# Altium schematic sheet Supply.SchDoc: Power Supply
size 420 x 297 mm; Author: G.K.; CompanyName: WUT; DrawnBy: G.K.; Organization: CERN; Address1: Warsaw Univeristy of Technology; Address2: Nowowiejska 15/19; DocumentNumber: 5; Revision: -; SheetNumber: 5; SheetTotal: 5; EDA_Number: ARTIQ; Projet: Sampler; ModifiedBy: -; CreateDate: XX/XX/XXXX; CheckedDate: -; Title2: converters + LDOs v2.2; DivGrp: ISE; Designer: G.K.; ModifiedDate: -; ProjectName: Sampler
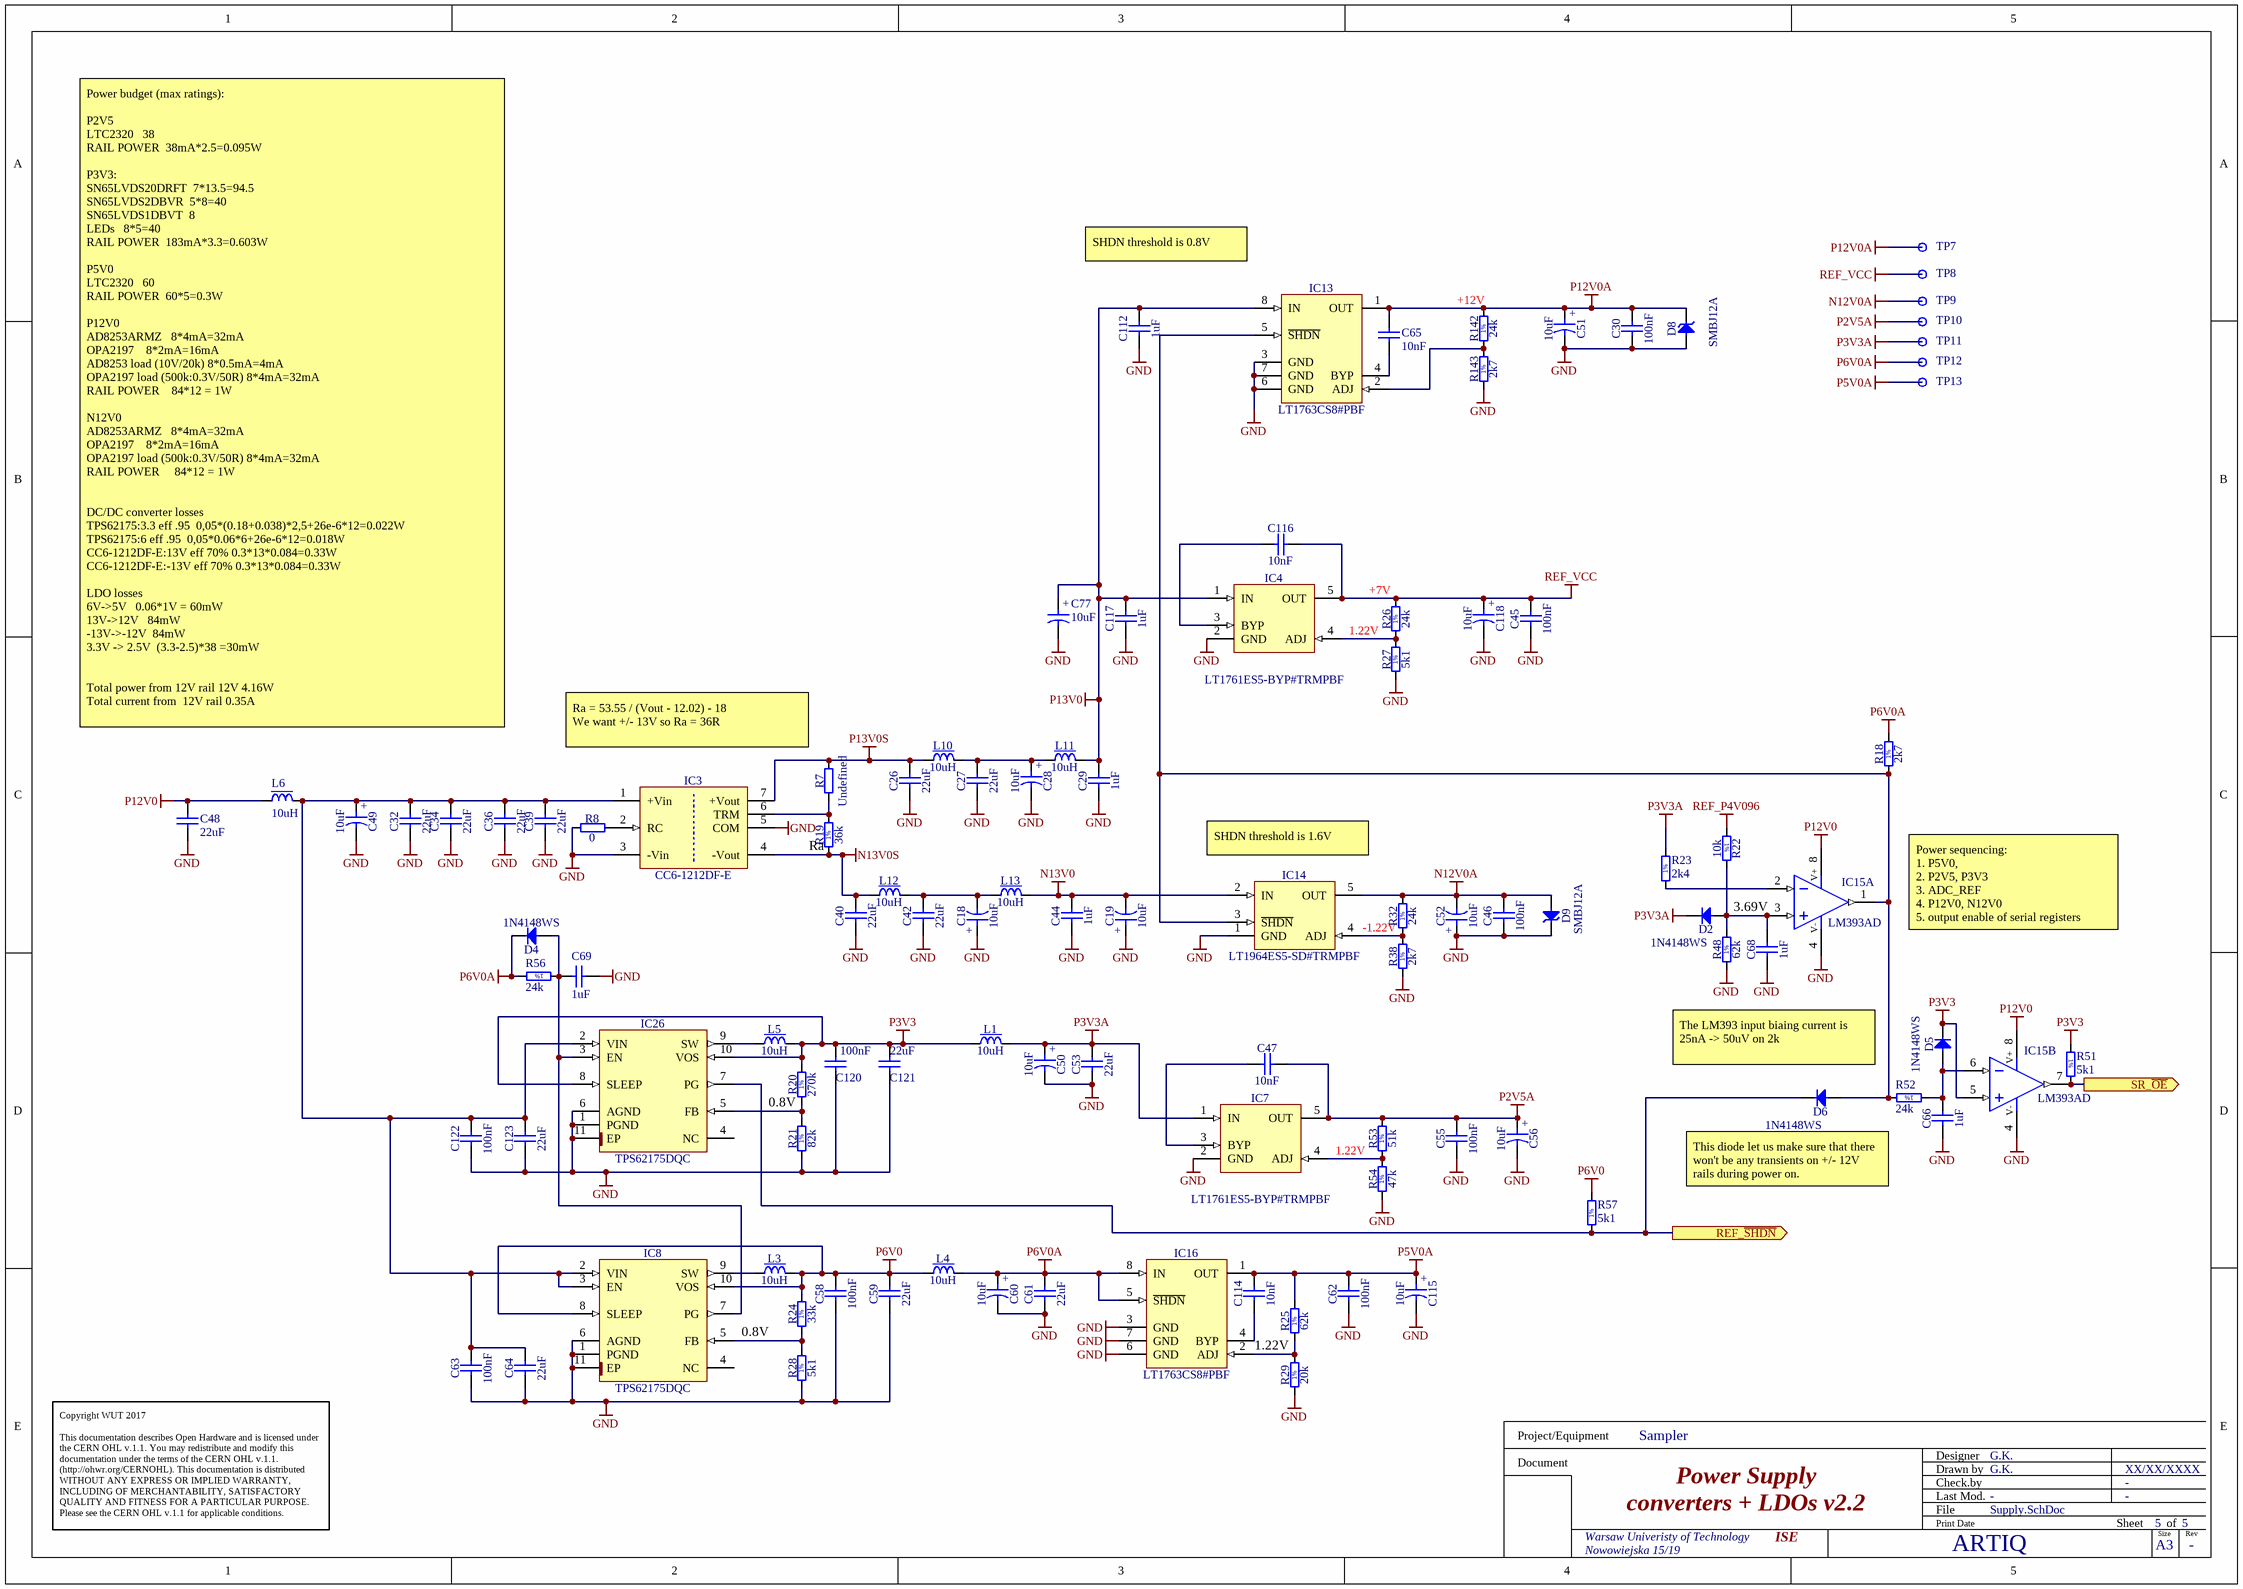
[diagram p0: Supply.SchDoc]

## Parts
C18  10uF  [CAPMP3216X180N]
C19  10uF  [CAPMP3216X180N]
C26  22uF  [CAPC2012X135N]
C27  22uF  [CAPC2012X135N]
C28  10uF  [CAPMP3216X180N]
C29  1uF  [CAPC1608X87N]
C30  100nF  [CAPC1005X55N]
C32  22uF  [CAPC2012X135N]
C34  22uF  [CAPC2012X135N]
C36  22uF  [CAPC2012X135N]
C39  22uF  [CAPC2012X135N]
C40  22uF  [CAPC2012X135N]
C42  22uF  [CAPC2012X135N]
C44  1uF  [CAPC1608X87N]
C45  100nF  [CAPC1005X55N]
C46  100nF  [CAPC1005X55N]
C47  10nF  [CAPC1608X87N]
C48  22uF  [CAPC2012X135N]
C49  10uF  [CAPMP3216X180N]
C50  10uF  [CAPMP3216X180N]
C51  10uF  [CAPMP3216X180N]
C52  10uF  [CAPMP3216X180N]
C53  22uF  [CAPC2012X135N]
C55  100nF  [CAPC1005X55N]
C56  10uF  [CAPMP3216X180N]
C58  100nF  [CAPC1005X55N]
C59  22uF  [CAPC2012X135N]
C60  10uF  [CAPMP3216X180N]
C61  22uF  [CAPC2012X135N]
C62  100nF  [CAPC1005X55N]
C63  100nF  [CAPC1005X55N]
C64  22uF  [CAPC2012X135N]
C65  10nF  [CAPC1608X87N]
C66  1uF  [CAPC1608X87N]
C68  1uF  [CAPC1608X87N]
C69  1uF  [CAPC1608X87N]
C77  10uF  [CAPMP3216X180N]
C112  1uF  [CAPC1608X87N]
C114  10nF  [CAPC1608X87N]
C115  10uF  [CAPMP3216X180N]
C116  10nF  [CAPC1608X87N]
C117  1uF  [CAPC1608X87N]
C118  10uF  [CAPMP3216X180N]
C120  100nF  [CAPC1005X55N]
C121  22uF  [CAPC2012X135N]
C122  100nF  [CAPC1005X55N]
C123  22uF  [CAPC2012X135N]
D2  1N4148WS  [SODFL2512X100N]
D4  1N4148WS  [SODFL2512X100N]
D5  1N4148WS  [SODFL2512X100N]
D6  1N4148WS  [SODFL2512X100N]
D8  SMBJ12A  [DIOM5336X265N]
D9  SMBJ12A  [DIOM5336X265N]
IC3  CC6-1212DF-E  [CC6-1212DF-E]
IC4  LT1761ES5-BYP#TRMPBF  [SOT95P280X100-5N]
IC7  LT1761ES5-BYP#TRMPBF  [SOT95P280X100-5N]
IC8  TPS62175DQC  [SON50P200X300X80-11N-R94X250]
IC13  LT1763CS8#PBF  [SOIC127P600X175-8N]
IC14  LT1964ES5-SD#TRMPBF  [SOT95P280X100-5N]
IC15  LM393AD  [SOIC127P600X175-8N]  (parts A,B of 2)
IC16  LT1763CS8#PBF  [SOIC127P600X175-8N]
IC26  TPS62175DQC  [SON50P200X300X80-11N-R94X250]
L1  10uH  [IND_MURATA-PS_8400]
L3  10uH  [IND_MURATA-PS_8400]
L4  10uH  [IND_MURATA-PS_8400]
L5  10uH  [IND_MURATA-PS_8400]
L6  10uH  [IND_MURATA-PS_8400]
L10  10uH  [IND_MURATA-PS_8400]
L11  10uH  [IND_MURATA-PS_8400]
L12  10uH  [IND_MURATA-PS_8400]
L13  10uH  [IND_MURATA-PS_8400]
R7  Undefined  [RESC1608X55N]
R8  0  [RESC1005X40N]
R18  2k7  [RESC1608X55N]
R19  36k  [RESC1608X55N]
R20  270k  [RESC1608X55N]
R21  82k  [RESC1608X55N]
R22  10k  [RESC1005X40N]
R23  2k4  [RESC1005X40N]
R24  33k  [RESC1005X40N]
R25  62k  [RESC1005X40N]
R26  24k  [RESC1608X55N]
R27  5k1  [RESC1005X40N]
R28  5k1  [RESC1005X40N]
R29  20k  [RESC1005X40N]
R32  24k  [RESC1608X55N]
R38  2k7  [RESC1608X55N]
R48  62k  [RESC1005X40N]
R51  5k1  [RESC1005X40N]
R52  24k  [RESC1608X55N]
R53  51k  [RESC1005X40N]
R54  47k  [RESC1005X40N]
R56  24k  [RESC1608X55N]
R57  5k1  [RESC1005X40N]
R142  24k  [RESC1608X55N]
R143  2k7  [RESC1608X55N]
TP7  Test Point  [TPS127]  (value not drawn)
TP8  Test Point  [TPS127]  (value not drawn)
TP9  Test Point  [TPS127]  (value not drawn)
TP10  Test Point  [TPS127]  (value not drawn)
TP11  Test Point  [TPS127]  (value not drawn)
TP12  Test Point  [TPS127]  (value not drawn)
TP13  Test Point  [TPS127]  (value not drawn)

## Ports
REF_~{SHDN} (out), SR_~{OE} (out)

## Nets
GND: C18.1 C19.1 C26.1 C27.1 C28.2 C29.1 C30.1 C32.1 C34.1 C36.1 C39.1 C40.1 C42.1 C44.1 C45.1 C46.1 C48.1 C49.2 C50.2 C51.2 C52.1 C53.1 C55.1 C56.2 C58.1 C59.1 C60.2 C61.1 C62.1 C63.1 C64.1 C66.1 C68.1 C69.1 C77.2 C112.1 C115.2 C117.1 C118.2 C120.1 C121.1 C122.1 C123.1 D8.2(A) D9.1(C) IC3.3(-Vin) IC3.5(COM) IC4.2(GND) IC7.2(GND) IC8.1(PGND) IC8.6(AGND) IC8.11(EP) IC13.3(GND) IC13.6(GND) IC13.7(GND) IC14.1(GND) IC15.4(V-) IC16.3(GND) IC16.6(GND) IC16.7(GND) IC26.1(PGND) IC26.6(AGND) IC26.11(EP) R8.1 R21.1 R27.1 R28.1 R29.1 R38.1 R48.1 R54.1 R143.1
N12V0A: C46.2 C52.2 D9.2(A) IC14.5(OUT) R32.2 TP9.1
N13V0: C19.2 C44.2 IC14.2(IN) L13.2
N13V0S: C40.2 IC3.4(-Vout) L12.1 R19.1
P2V5A: C47.2 C55.2 C56.1 IC7.5(OUT) R53.2 TP10.1
P3V3: C120.2 C121.2 D5.1(C) IC15.5(IN+) IC26.8(SLEEP) IC26.10(VOS) L1.1 L5.2 R20.2 R51.1
P3V3A: C50.1 C53.2 D2.1(C) IC7.1(IN) L1.2 R23.2 TP11.1
P5V0A: C62.2 C114.2 C115.1 IC16.1(OUT) R25.2 TP13.1
P6V0: C58.2 C59.2 IC8.8(SLEEP) IC8.10(VOS) L3.2 L4.1 R24.2 R57.2
P6V0A: C60.1 C61.2 D4.1(C) IC16.5(~{SHDN}) IC16.8(IN) L4.2 R18.2 R56.2 TP12.1
P12V0: C48.2 IC15.8(V+) L6.1
P12V0A: C30.2 C51.1 C65.2 D8.1(C) IC13.1(OUT) R142.2 TP7.1
P13V0: C29.2 C77.1 C112.2 C117.2 IC4.1(IN) IC13.8(IN) L11.2
P13V0S: C26.2 IC3.7(+Vout) L10.1 R7.2
REF_P4V096: R22.1
REF_VCC: C45.2 C116.2 C118.1 IC4.5(OUT) R26.2 TP8.1
REF_~{SHDN}: D6.1(C) IC26.7(PG) R57.1 ; port REF_~{SHDN}
SR_~{OE}: IC15.7(OUT) R51.2 ; port SR_~{OE}
NetC18_2: C18.2 C42.2 L12.2 L13.1
NetC27_2: C27.2 C28.1 L10.2 L11.1
NetC32_2: C32.2 C34.2 C36.2 C39.2 C49.1 C63.2 C64.2 C122.2 C123.2 IC3.1(+Vin) IC8.2(VIN) IC8.3(EN) IC26.2(VIN) L6.2
NetC47_1: C47.1 IC7.3(BYP)
NetC65_1: C65.1 IC13.4(BYP)
NetC66_2: C66.2 D5.2(A) IC15.6(IN-) R52.1
NetC68_2: C68.2 D2.2(A) IC15.3(IN+) R22.2 R48.2
NetC69_2: C69.2 D4.2(A) IC8.7(PG) IC26.3(EN) R56.1
NetC114_1: C114.1 IC16.4(BYP)
NetC116_1: C116.1 IC4.3(BYP)
NetD6_2: D6.2(A) IC13.5(~{SHDN}) IC14.3(~{SHDN}) IC15.1(OUT) R18.1 R52.2
NetIC3_2: IC3.2(RC) R8.2
NetIC3_6: IC3.6(TRM) R7.1 R19.2
NetIC4_4: IC4.4(ADJ) R26.1 R27.2
NetIC7_4: IC7.4(ADJ) R53.1 R54.2
NetIC8_5: IC8.5(FB) R24.1 R28.2
NetIC8_9: IC8.9(SW) L3.1
NetIC13_2: IC13.2(ADJ) R142.1 R143.2
NetIC14_4: IC14.4(ADJ) R32.1 R38.2
NetIC15_2: IC15.2(IN-) R23.1
NetIC16_2: IC16.2(ADJ) R25.1 R29.2
NetIC26_5: IC26.5(FB) R20.1 R21.2
NetIC26_9: IC26.9(SW) L5.1

Not connected (* = marked no-connect by the designer): IC8 4(NC); IC26 4(NC)

## Notes on the sheet
- SHDN threshold is 0.8V
- (near R142) +12V
- (near R26) +7V
- 1.22V
- Power budget (max ratings):
  P2V5
  LTC2320			38
  RAIL POWER		38mA*2.5=0.095W
  P3V3:
  SN65LVDS20DRFT		7*13.5=94.5
  SN65LVDS2DBVR		5*8=40
  SN65LVDS1DBVT		8
  LEDs			8*5=40
  RAIL POWER		183mA*3.3=0.603W
  P5V0
  LTC2320			60
  RAIL POWER		60*5=0.3W
  P12V0
  AD8253ARMZ 		8*4mA=32mA
  OPA2197 			8*2mA=16mA
  AD8253 load (10V/20k)	8*0.5mA=4mA
  OPA2197 load (500k:0.3V/50R)	8*4mA=32mA
  RAIL POWER 		 84*12 = 1W
  N12V0
  AD8253ARMZ 		8*4mA=32mA
  OPA2197 			8*2mA=16mA
  OPA2197 load (500k:0.3V/50R)	8*4mA=32mA
  RAIL POWER  		 84*12 = 1W
  DC/DC converter losses
  TPS62175:3.3 eff .95		0,05*(0.18+0.038)*2,5+26e-6*12=0.022W
  TPS62175:6 eff .95		0,05*0.06*6+26e-6*12=0.018W
  CC6-1212DF-E:13V eff 70%	0.3*13*0.084=0.33W
  CC6-1212DF-E:-13V eff 70%	0.3*13*0.084=0.33W
  LDO losses
  6V->5V			0.06*1V = 60mW
  13V->12V			84mW
  -13V->-12V		84mW
  3.3V -> 2.5V		(3.3-2.5)*38 =30mW
  Total power from 12V rail	12V 4.16W
  Total current from  12V rail	0.35A
- (near R7) Ra = 53.55 / (Vout - 12.02) - 18
  We want +/- 13V so Ra = 36R
- (near R19) Ra
- SHDN threshold is 1.6V
- -1.22V
- 3.69V
- Power sequencing:
  1. P5V0,
  2. P2V5, P3V3
  3. ADC_REF
  4. P12V0, N12V0
  5. output enable of serial registers
- The LM393 input biaing current is 25nA -> 50uV on 2k
- (near R20) 0.8V
- This diode let us make sure that there won't be any transients on +/- 12V rails during power on.
- 0.8V
- Copyright WUT 2017
  This documentation describes Open Hardware and is licensed under the CERN OHL v.1.1. You may redistribute and modify this documentation under the terms of the CERN OHL v.1.1. (http://ohwr.org/CERNOHL). This documentation is distributed WITHOUT ANY EXPRESS OR IMPLIED WARRANTY, INCLUDING OF MERCHANTABILITY, SATISFACTORY QUALITY AND FITNESS FOR A PARTICULAR PURPOSE. Please see the CERN OHL v.1.1 for applicable conditions.
- Project/Equipment
- Document
- Designer
- Drawn by
- Check.by
- File
- Last Mod.
- Print Date
- Sheet
- Size
- A3
- of
- Rev
- (in symbol CTE3216-18_10UF_16V_20%_AVX_TCJ) +
- (in symbol R0402_2K4_1%_0.0625W_100PPM) 1%
- (in symbol R0402_5K1_1%_0.0625W_100PPM) 1%
- (in symbol R0402_10K_1%_0.0625W_100PPM) 1%
- (in symbol R0402_20K_1%_0.0625W_100PPM) 1%
- (in symbol R0402_33K_1%_0.0625W_100PPM) 1%
- (in symbol R0402_47K_1%_0.0625W_100PPM) 1%
- (in symbol R0402_51K_1%_0.0625W_100PPM) 1%
- (in symbol R0402_62K_1%_0.0625W_100PPM) 1%
- (in symbol R0603_2K7_1%_0.1W_100PPM) 1%
- (in symbol R0603_24K_1%_0.1W_100PPM) 1%
- (in symbol R0603_36K_1%_0.1W_100PPM) 1%
- (in symbol R0603_82K_1%_0.1W_100PPM) 1%
- (in symbol R0603_270K_1%_0.1W_100PPM) 1%

## Library data of the parts
C18 C19 C28 C49-C52 C56 C60 C77 C115 C118 = CTE3216-18_10UF_16V_20%_AVX_TCJ: Polarised capacitor; Part Description: ESR 0R200 Tantalum Solid Electrolytic Chip Capacitor with Conductive Polymer Electrode; Manufacturer: AVX; Manufacturer Part Number: TCJA106M016R0200; Voltage: 16V; Tolerance: ±20%; Part Number: CTE3216-18_10UF_16V_20%_AVX_TCJ; Component Kind: Standard; Component Type: Standard; Pin Count: 2; Value: 10uF; Status: Preferred; Case: A; Mounted: Yes; Socket: No; SMD: Yes; Sense: No; ComponentHeight: 1.8mm; HelpURL: \\cern.ch\dfs\Applications\Altium\Datasheets\CTE_AVX_TCJ.pdf; Author: CERN DEM JLC; CreateDate: 29.03.2012; LatestRevisionDate: 29.03.2012
C26 C27 C32 C34 C36 C39 C40 C42 C48 C53 C59 C61 C64 C121 C123 = CC0805_22UF_16V_10%_X5R: Non-polarised capacitor; Part Description: SMD Multilayer Chip Ceramic Capacitor; Manufacturer: GENERIC; Manufacturer1 Part Number: C2012X5R1C226KT; Voltage: 16V; TC: X5R; Tolerance: ±10%; Part Number: CC0805_22UF_16V_10%_X5R; Component Kind: Standard; Component Type: Standard; Pin Count: 2; Value: 22uF; Status: Preferred; Manufacturer Part Number: CC0805_22UF_16V_10%_X5R; Case: 0805; Mounted: Yes; Socket: No; SMD: Yes; Sense: No; Manufacturer1 Example: TDK; Manufacturer1 ComponentHeight: 1.35mm; HelpURL: \\cern.ch\dfs\Applications\Altium\Datasheets\CC0805_X5R_TDK_C.pdf; Author: CERN DEM JLC; CreateDate: 25.10.2012; LatestRevisionDate: 25.10.2012
C29 C44 C66 C68 C69 C112 C117 = CC0603_1UF_25V_10%_X7R: Non-polarised capacitor; Part Description: SMD Multilayer Chip Ceramic Capacitor; Manufacturer: GENERIC; Manufacturer1 Part Number: GRM188R71E105KA12D; Voltage: 25V; TC: X7R; Tolerance: ±10%; Part Number: CC0603_1UF_25V_10%_X7R; Component Kind: Standard; Component Type: Standard; Pin Count: 2; Value: 1uF; Status: None; Manufacturer Part Number: CC0603_1UF_25V_10%_X7R; Case: 0603; Mounted: Yes; Socket: No; SMD: Yes; Sense: No; Manufacturer1 Example: MURATA; Manufacturer1 ComponentHeight: 0.9mm; HelpURL: \\cern.ch\dfs\Applications\Altium\Datasheets\CC0603_X7R_MURATA.pdf; Author: CERN DEM JLC; CreateDate: 18.01.2011; LatestRevisionDate: 18.01.2011
C30 C45 C46 C55 C58 C62 C63 C120 C122 = CC0402_100NF_16V_10%_X5R: Non-polarised capacitor; Part Description: SMD Multilayer Chip Ceramic Capacitor; Manufacturer: GENERIC; Manufacturer1 Part Number: GRM155R61C104KA88D; Voltage: 16V; TC: X5R; Tolerance: ±10%; Part Number: CC0402_100NF_16V_10%_X5R; Component Kind: Standard; Component Type: Standard; Pin Count: 2; Value: 100nF; Status: None; Manufacturer Part Number: CC0402_100NF_16V_10%_X5R; Case: 0402; Mounted: Yes; Socket: No; SMD: Yes; Sense: No; Manufacturer1 Example: MURATA; Manufacturer1 ComponentHeight: 0.55mm; HelpURL: \\cern.ch\dfs\Applications\Altium\Datasheets\CC0402_X5R_MURATA_GRM.pdf; Author: CERN DEM JLC; CreateDate: 10.12.2013; LatestRevisionDate: 10.12.2013
C47 C65 C114 C116 = CC0603_10NF_50V_10%_X7R: Non-polarised capacitor; Part Description: SMD Multilayer Chip Ceramic Capacitor; Manufacturer: GENERIC; Manufacturer1 Part Number: 223858615636; Voltage: 50V; TC: X7R; Tolerance: ±10%; Part Number: CC0603_10NF_50V_10%_X7R; Component Kind: Standard; Component Type: Standard; Pin Count: 2; Value: 10nF; Status: Preferred; Manufacturer Part Number: CC0603_10NF_50V_10%_X7R; Case: 0603; Mounted: Yes; Socket: No; SMD: Yes; Sense: No; Manufacturer1 Example: PHYCOMP; Manufacturer1 ComponentHeight: 0.87mm; HelpURL: \\cern.ch\dfs\Applications\Altium\Datasheets\CC0603_X7R_PHYCOMP.pdf; Author: CERN DEM JLC; CreateDate: 03.12.2007; LatestRevisionDate: 03.12.2007
D2 D4-D6 = 1N4148WS: Diode; Part Description: Small Signal Diodes; Manufacturer: FAIRCHILD SEMICONDUCTOR; Voltage: 75V; Power: 150mA; PressFit: No; Bonding: No; Part Number: 1N4148WS; Component Kind: Standard; Component Type: Standard; Device: 1N4148WS; PackageDescription: SODFL Diode; 1.70mm W X 1.25mm L X 1.00mm H body, IPC Medium Density; Manufacturer Part Number: 1N4148WS; Pin Count: 2; Case: SOD-323F; Mounted: Yes; Socket: No; SMD: Yes; Sense: No; ComponentHeight: 1mm; HelpURL: \\cern.ch\dfs\Applications\Altium\Datasheets\1N4148WS.pdf; Author: CERN DEM JLC; CreateDate: 12.05.2011; LatestRevisionDate: 12.05.2011
D8 D9 = SMBJ12A: Zener Diode; Part Description: Uni-Directional Transient Voltage Suppressor Diode; Manufacturer: FAIRCHILD SEMICONDUCTOR; Voltage: 12V; Power: 600W; PressFit: No; Bonding: No; Part Number: SMBJ12A; Component Kind: Standard; Component Type: Standard; Device: SMBJ12A; PackageDescription: DO-214-AA/SMB Diode, Molded Body; 5.34mm L X 3.625mm W X 2.65mm H, IPC Medium Density; Manufacturer Part Number: SMBJ12A; Pin Count: 2; Case: DO-214AA; Mounted: Yes; Socket: No; SMD: Yes; Sense: No; ComponentHeight: 2.65mm; HelpURL: \\cern.ch\dfs\Applications\Altium\Datasheets\SMBJ.pdf; Author: CERN DEM JLC; CreateDate: 10.04.2013; LatestRevisionDate: 10.04.2013
IC3 = DC/DC_CC6-1212DF-E: CONV DC/DC 6W DUAL 12V +-12V PCB; Manufacturer: TDK-Lambda Americas Inc.; PressFit: No; Bonding: No; Part Number: CC6-1212DF-E; Component Kind: Standard; Component Type: Standard; Device: CC6-1212DF-E; PackageDescription: CC6 Series, Body 0.900 x 0.831 x 0.335, Regulated; Part Description: CONV DC/DC 6W DUAL 12V +-12V PCB; Manufacturer Part Number: CC6-1212DF-E; Pin Count: 7; Mounted: Yes; Socket: No; SMD: No; Sense: No; ComponentHeight: 10.45mm; Author: GK; CreateDate: 17.12.2016; LatestRevisionDate: 17.12.2016
IC4 IC7 = LT1761ES5-BYP#TRMPBF: 100mA, Low Noise, LDO Micropower Adjustable Regulator in SOT-23; Part Description: 1.22V to 20V, 100mA, Low Noise, LDO Adjustable Micropower Regulator; Manufacturer: LINEAR TECHNOLOGY; PressFit: No; Bonding: No; Part Number: LT1761ES5-BYP#TRMPBF; Component Kind: Standard; Component Type: Standard; Device: LT1761ES5-BYP#TRMPBF; PackageDescription: SOT23, 0.95mm pitch; 5 pin, 1.6mm W X 2.9mm L, IPC Medium Density; Manufacturer Part Number: LT1761ES5-BYP#TRMPBF; Pin Count: 5; Case: SOT23; Mounted: Yes; Socket: No; SMD: Yes; Sense: No; ComponentHeight: 1mm; HelpURL: \\cern.ch\dfs\Applications\Altium\Datasheets\LT1761ES5-SD#TRMPBF.pdf; Author: CERN DEM MR; CreateDate: 17.02.2016; LatestRevisionDate: 17.02.2016
IC8 IC26 = TPS62175DQC: 4.75-28VDC to 1-6VDC, 500mA Step-Down Converter With Sleep Mode; Manufacturer: TEXAS INSTRUMENTS; PressFit: No; Bonding: No; Part Number: TPS62175DQC; Component Kind: Standard; Component Type: Standard; Device: TPS62175DQC; PackageDescription: SON, 10-Leads, Body 2x3mm, Pitch 0.5mm, Thermal Pad 0.94x2.5mm, IPC Medium Density; Part Description: 4.75-28VDC to 1-6VDC, 500mA Step-Down Converter With Sleep Mode; Manufacturer Part Number: TPS62175DQC; Pin Count: 11; Case: SON10; Mounted: Yes; Socket: No; SMD: Yes; Sense: No; ComponentHeight: 0.8mm; HelpURL: \\cern.ch\dfs\Applications\Altium\Datasheets\TPS62175DQC.pdf; Author: CERN DEM JMW; CreateDate: 11.08.2015; LatestRevisionDate: 11.08.2015
IC13 IC16 = LT1763CS8#PBF: 1.22V to 20V 500mA, Low Noise, LDO Adjustable Micropower Regulator; Manufacturer: LINEAR TECHNOLOGY; PressFit: No; Bonding: No; Part Number: LT1763CS8#PBF; Component Kind: Standard; Component Type: Standard; Device: LT1763CS8#PBF; PackageDescription: SOIC 8, Pitch 1.27mm, Body 4x5mm, IPC Medium Density; Part Description: 1.22V to 20V 500mA, Low Noise, LDO Adjustable Micropower Regulator; Manufacturer Part Number: LT1763CS8#PBF; Pin Count: 8; Case: SOIC8; Mounted: Yes; Socket: No; SMD: Yes; Sense: No; ComponentHeight: 1.75mm; HelpURL: \\cern.ch\dfs\Applications\Altium\Datasheets\LT1763CS8#PBF.pdf; Author: CERN DEM JLC; CreateDate: 11.01.2010; LatestRevisionDate: 11.01.2010
IC14 = LT1964ES5-SD#TRMPBF: 200mA, Low Noise, Low Dropout Negative Micropower Regulator; Part Description: -1.22V to -20V, 200mA, Low Noise, Low Dropout Negative Micropower Regulator; Manufacturer: LINEAR TECHNOLOGY; PressFit: No; Bonding: No; Part Number: LT1964ES5-SD#TRMPBF; Component Kind: Standard; Component Type: Standard; Device: LT1964ES5-SD#TRMPBF; PackageDescription: SOT23, 0.95mm pitch; 5 pin, 1.75mm W X 3.00mm L, IPC Medium Density; Manufacturer Part Number: LT1964ES5-SD#TRMPBF; Pin Count: 5; Case: SOT23-5; Mounted: Yes; Socket: No; SMD: Yes; Sense: No; ComponentHeight: 1mm; HelpURL: \\cern.ch\dfs\Applications\Altium\Datasheets\LT1964ES5-SD#TRMPBF.pdf; Author: CERN DEM JLC; CreateDate: 05.05.2009; LatestRevisionDate: 05.05.2009
IC15 = LM393AD: Dual Operational Amplifier; Part Description: Dual Differential Comparator; Manufacturer: TEXAS INSTRUMENTS; PressFit: No; Bonding: No; Part Number: LM393AD; Component Kind: Standard; Component Type: Standard; Device: LM393AD; PackageDescription: SOIC 8, Pitch 1.27mm - Body 4x5mm, IPC Medium Density; Manufacturer Part Number: LM393AD; Pin Count: 8; Case: SOIC8; Mounted: Yes; Socket: No; SMD: Yes; Sense: No; ComponentHeight: 1.75mm; Author: CERN DEM JLC; HelpURL: \\cern.ch\dfs\Applications\Altium\Datasheets\LM393AD.pdf; CreateDate: 22.10.2013; LatestRevisionDate: 22.10.2013
L1 L3-L6 L10-L13 = IND_10UH_10%_MURATA-PS_8400: Inductor With Core; Part Description: Miniature Surface Mount Power Inductor (8400 Serie); Manufacturer: MURATA POWER SOLUTIONS; Manufacturer Part Number: 84103C; Power: 950mA; Resistance: 0.24R; Tolerance: ±10%; Part Number: IND_10UH_10%_MURATA-PS_8400; Component Kind: Standard; Component Type: Standard; Pin Count: 2; Value: 10uH; Status: None; Mounted: Yes; Socket: No; SMD: Yes; Sense: No; ComponentHeight: 2.9mm; HelpURL: \\cern.ch\dfs\Applications\Altium\Datasheets\IND_MURATA-PS_8400.pdf; Author: CERN DEM JLC; CreateDate: 02.07.2012; LatestRevisionDate: 02.07.2012
R7 = R0603_NO-VALUE: Resistor; Part Description: Reserved Footprint For a 0603 (1608) Chip Resistor; Mounted: No; Part Number: R0603_NO-VALUE; Component Kind: Standard; Component Type: Standard; Pin Count: 2; Value: Undefined; Status: None; Manufacturer: Undefined; Manufacturer Part Number: R0603_NO-VALUE; Case: 0603; Sense: No; Socket: No; SMD: Yes; Manufacturer1 Example: Undefined; Manufacturer1 Part Number: Undefined; Manufacturer1 ComponentHeight: Undefined; HelpURL: Undefined; Author: CERN DEM JLC; CreateDate: 03.12.2007; LatestRevisionDate: 13.03.2008
R8 = R0402_0R_JUMPER: Resistor; Part Description: 1A (0.05R Max DC Resistance) Zero Ohm Jumper; Manufacturer: GENERIC; Manufacturer1 Part Number: 232270591001L; Part Number: R0402_0R_JUMPER; Component Kind: Standard; Component Type: Standard; Pin Count: 2; Value: 0; Status: Not recommended; Manufacturer Part Number: R0402_0R_JUMPER; Case: 0402; Mounted: Yes; Sense: No; Socket: No; SMD: Yes; Manufacturer1 Example: YAGEO PHYCOMP; Manufacturer1 ComponentHeight: 0.4mm; HelpURL: \\cern.ch\dfs\Applications\Altium\Datasheets\R0402_Phycomp_RC0402.pdf; Author: CERN DEM JLC; CreateDate: 03.12.2007; LatestRevisionDate: 17.10.2012
R18 R38 R143 = R0603_2K7_1%_0.1W_100PPM: Resistor - 1%; Part Description: General Purpose Thick Film Chip Resistor; Manufacturer: GENERIC; Manufacturer1 Part Number: RC0603FR-072K7L; Power: 0.1W; TC: ±100ppm/°C; Part Number: R0603_2K7_1%_0.1W_100PPM; Component Kind: Standard; Component Type: Standard; Pin Count: 2; Value: 2k7; Status: Preferred; Tolerance: ±1%; Manufacturer Part Number: R0603_2K7_1%_0.1W_100PPM; Case: 0603; Mounted: Yes; Sense: No; Socket: No; SMD: Yes; Manufacturer1 Example: YAGEO PHYCOMP; Manufacturer1 ComponentHeight: 0.55mm; HelpURL: \\cern.ch\dfs\Applications\Altium\Datasheets\R0603_PHYCOMP_RC0603.pdf; Author: CERN DEM JLC; CreateDate: 02.05.2011; LatestRevisionDate: 02.05.2011
R19 = R0603_36K_1%_0.1W_100PPM: Resistor - 1%; Part Description: General Purpose Thick Film Chip Resistor; Manufacturer: GENERIC; Manufacturer1 Part Number: NRC06F3602TRF; Power: 0.1W; TC: ±100ppm/°C; PressFit: No; Part Number: R0603_36K_1%_0.1W_100PPM; Component Kind: Standard; Component Type: Standard; Pin Count: 2; Value: 36k; Status: Preferred; Tolerance: ±1%; Manufacturer Part Number: R0603_36K_1%_0.1W_100PPM; Case: 0603; Mounted: Yes; Sense: No; Socket: No; SMD: Yes; Manufacturer1 Example: NIC COMPONENT; Manufacturer1 ComponentHeight: 0.55mm; HelpURL: \\cern.ch\dfs\Applications\Altium\Datasheets\R0603_NIC_NRC.pdf; Author: CERN DEM JLC; CreateDate: 03.12.2007; LatestRevisionDate: 13.03.2008
R20 = R0603_270K_1%_0.1W_100PPM: Resistor - 1%; Part Description: General Purpose Thick Film Chip Resistor; Manufacturer: GENERIC; Manufacturer1 Part Number: NRC06F2703TRF; Power: 0.1W; TC: ±100ppm/°C; Part Number: R0603_270K_1%_0.1W_100PPM; Component Kind: Standard; Component Type: Standard; Pin Count: 2; Value: 270k; Status: Preferred; Tolerance: ±1%; Manufacturer Part Number: R0603_270K_1%_0.1W_100PPM; Case: 0603; Mounted: Yes; Sense: No; Socket: No; SMD: Yes; Manufacturer1 Example: NIC COMPONENT; Manufacturer1 ComponentHeight: 0.55mm; HelpURL: \\cern.ch\dfs\Applications\Altium\Datasheets\R0603_NIC_NRC.pdf; Author: CERN DEM JLC; CreateDate: 03.12.2007; LatestRevisionDate: 13.03.2008
R21 = R0603_82K_1%_0.1W_100PPM: Resistor - 1%; Part Description: General Purpose Thick Film Chip Resistor; Manufacturer: GENERIC; Manufacturer1 Part Number: NRC06F8202TRF; Power: 0.1W; TC: ±100ppm/°C; Part Number: R0603_82K_1%_0.1W_100PPM; Component Kind: Standard; Component Type: Standard; Pin Count: 2; Value: 82k; Status: Preferred; Tolerance: ±1%; Manufacturer Part Number: R0603_82K_1%_0.1W_100PPM; Case: 0603; Mounted: Yes; Sense: No; Socket: No; SMD: Yes; Manufacturer1 Example: NIC COMPONENT; Manufacturer1 ComponentHeight: 0.55mm; HelpURL: \\cern.ch\dfs\Applications\Altium\Datasheets\R0603_NIC_NRC.pdf; Author: CERN DEM JLC; CreateDate: 03.12.2007; LatestRevisionDate: 13.03.2008
R22 = R0402_10K_1%_0.0625W_100PPM: Resistor - 1%; Part Description: General Purpose Thick Film Chip Resistor; Manufacturer: GENERIC; Manufacturer1 Part Number: 232270671003L; TC: ±100ppm/°C; PressFit: No; Part Number: R0402_10K_1%_0.0625W_100PPM; Component Kind: Standard; Component Type: Standard; Pin Count: 2; Value: 10k; Status: Not Recommended; Power: 0.0625W; Tolerance: ±1%; Manufacturer Part Number: R0402_10K_1%_0.0625W_100PPM; Case: 0402; Mounted: Yes; Sense: No; Socket: No; SMD: Yes; Manufacturer1 Example: YAGEO PHYCOMP; Manufacturer1 ComponentHeight: 0.4mm; HelpURL: \\cern.ch\dfs\Applications\Altium\Datasheets\R0402_Phycomp_RC0402.pdf; Author: CERN DEM JLC; CreateDate: 03.12.2007; LatestRevisionDate: 17.10.2012
R23 = R0402_2K4_1%_0.0625W_100PPM: Resistor - 1%; Part Description: General Purpose Thick Film Chip Resistor; Manufacturer: GENERIC; Manufacturer1 Part Number: 232270672402L; TC: ±100ppm/°C; PressFit: No; Part Number: R0402_2K4_1%_0.0625W_100PPM; Component Kind: Standard; Component Type: Standard; Pin Count: 2; Value: 2k4; Status: Not Recommended; Power: 0.0625W; Tolerance: ±1%; Manufacturer Part Number: R0402_2K4_1%_0.0625W_100PPM; Case: 0402; Mounted: Yes; Sense: No; Socket: No; SMD: Yes; Manufacturer1 Example: YAGEO PHYCOMP; Manufacturer1 ComponentHeight: 0.4mm; HelpURL: \\cern.ch\dfs\Applications\Altium\Datasheets\R0402_Phycomp_RC0402.pdf; Author: CERN DEM JLC; CreateDate: 03.12.2007; LatestRevisionDate: 17.10.2012
R24 = R0402_33K_1%_0.0625W_100PPM: Resistor - 1%; Part Description: General Purpose Thick Film Chip Resistor; Manufacturer: GENERIC; Manufacturer1 Part Number: 232270673303L; TC: ±100ppm/°C; PressFit: No; Part Number: R0402_33K_1%_0.0625W_100PPM; Component Kind: Standard; Component Type: Standard; Pin Count: 2; Value: 33k; Status: Not Recommended; Power: 0.0625W; Tolerance: ±1%; Manufacturer Part Number: R0402_33K_1%_0.0625W_100PPM; Case: 0402; Mounted: Yes; Sense: No; Socket: No; SMD: Yes; Manufacturer1 Example: YAGEO PHYCOMP; Manufacturer1 ComponentHeight: 0.4mm; HelpURL: \\cern.ch\dfs\Applications\Altium\Datasheets\R0402_Phycomp_RC0402.pdf; Author: CERN DEM JLC; CreateDate: 03.12.2007; LatestRevisionDate: 17.10.2012
R25 R48 = R0402_62K_1%_0.0625W_100PPM: Resistor - 1%; Part Description: General Purpose Thick Film Chip Resistor; Manufacturer: GENERIC; Manufacturer1 Part Number: 232270676203L; TC: ±100ppm/°C; PressFit: No; Part Number: R0402_62K_1%_0.0625W_100PPM; Component Kind: Standard; Component Type: Standard; Pin Count: 2; Value: 62k; Status: Not Recommended; Power: 0.0625W; Tolerance: ±1%; Manufacturer Part Number: R0402_62K_1%_0.0625W_100PPM; Case: 0402; Mounted: Yes; Sense: No; Socket: No; SMD: Yes; Manufacturer1 Example: YAGEO PHYCOMP; Manufacturer1 ComponentHeight: 0.4mm; HelpURL: \\cern.ch\dfs\Applications\Altium\Datasheets\R0402_Phycomp_RC0402.pdf; Author: CERN DEM JLC; CreateDate: 03.12.2007; LatestRevisionDate: 17.10.2012
R26 R32 R52 R56 R142 = R0603_24K_1%_0.1W_100PPM: Resistor - 1%; Part Description: General Purpose Thick Film Chip Resistor; Manufacturer: GENERIC; Manufacturer1 Part Number: NRC06F2402TRF; Power: 0.1W; TC: ±100ppm/°C; Part Number: R0603_24K_1%_0.1W_100PPM; Component Kind: Standard; Component Type: Standard; Pin Count: 2; Value: 24k; Status: Preferred; Tolerance: ±1%; Manufacturer Part Number: R0603_24K_1%_0.1W_100PPM; Case: 0603; Mounted: Yes; Sense: No; Socket: No; SMD: Yes; Manufacturer1 Example: NIC COMPONENT; Manufacturer1 ComponentHeight: 0.55mm; HelpURL: \\cern.ch\dfs\Applications\Altium\Datasheets\R0603_NIC_NRC.pdf; Author: CERN DEM JLC; CreateDate: 03.12.2007; LatestRevisionDate: 13.03.2008
R27 R28 R51 R57 = R0402_5K1_1%_0.0625W_100PPM: Resistor - 1%; Part Description: General Purpose Thick Film Chip Resistor; Manufacturer: GENERIC; Manufacturer1 Part Number: 232270675102L; TC: ±100ppm/°C; PressFit: No; Part Number: R0402_5K1_1%_0.0625W_100PPM; Component Kind: Standard; Component Type: Standard; Pin Count: 2; Value: 5k1; Status: Not Recommended; Power: 0.0625W; Tolerance: ±1%; Manufacturer Part Number: R0402_5K1_1%_0.0625W_100PPM; Case: 0402; Mounted: Yes; Sense: No; Socket: No; SMD: Yes; Manufacturer1 Example: YAGEO PHYCOMP; Manufacturer1 ComponentHeight: 0.4mm; HelpURL: \\cern.ch\dfs\Applications\Altium\Datasheets\R0402_Phycomp_RC0402.pdf; Author: CERN DEM JLC; CreateDate: 03.12.2007; LatestRevisionDate: 17.10.2012
R29 = R0402_20K_1%_0.0625W_100PPM: Resistor - 1%; Part Description: General Purpose Thick Film Chip Resistor; Manufacturer: GENERIC; Manufacturer1 Part Number: 232270672003L; TC: ±100ppm/°C; PressFit: No; Part Number: R0402_20K_1%_0.0625W_100PPM; Component Kind: Standard; Component Type: Standard; Pin Count: 2; Value: 20k; Status: Not Recommended; Power: 0.0625W; Tolerance: ±1%; Manufacturer Part Number: R0402_20K_1%_0.0625W_100PPM; Case: 0402; Mounted: Yes; Sense: No; Socket: No; SMD: Yes; Manufacturer1 Example: YAGEO PHYCOMP; Manufacturer1 ComponentHeight: 0.4mm; HelpURL: \\cern.ch\dfs\Applications\Altium\Datasheets\R0402_Phycomp_RC0402.pdf; Author: CERN DEM JLC; CreateDate: 03.12.2007; LatestRevisionDate: 17.10.2012
R53 = R0402_51K_1%_0.0625W_100PPM: Resistor - 1%; Part Description: General Purpose Thick Film Chip Resistor; Manufacturer: GENERIC; Manufacturer1 Part Number: 232270674703L; TC: ±100ppm/°C; PressFit: No; Part Number: R0402_51K_1%_0.0625W_100PPM; Component Kind: Standard; Component Type: Standard; Pin Count: 2; Value: 51k; Status: Not Recommended; Power: 0.0625W; Tolerance: ±1%; Manufacturer Part Number: R0402_51K_1%_0.0625W_100PPM; Case: 0402; Mounted: Yes; Sense: No; Socket: No; SMD: Yes; Manufacturer1 Example: YAGEO PHYCOMP; Manufacturer1 ComponentHeight: 0.4mm; HelpURL: \\cern.ch\dfs\Applications\Altium\Datasheets\R0402_Phycomp_RC0402.pdf; Author: CERN DEM JLC; CreateDate: 03.12.2007; LatestRevisionDate: 17.10.2012
R54 = R0402_47K_1%_0.0625W_100PPM: Resistor - 1%; Part Description: General Purpose Thick Film Chip Resistor; Manufacturer: GENERIC; Manufacturer1 Part Number: 232270675103L; TC: ±100ppm/°C; PressFit: No; Part Number: R0402_47K_1%_0.0625W_100PPM; Component Kind: Standard; Component Type: Standard; Pin Count: 2; Value: 47k; Status: Not Recommended; Power: 0.0625W; Tolerance: ±1%; Manufacturer Part Number: R0402_47K_1%_0.0625W_100PPM; Case: 0402; Mounted: Yes; Sense: No; Socket: No; SMD: Yes; Manufacturer1 Example: YAGEO PHYCOMP; Manufacturer1 ComponentHeight: 0.4mm; HelpURL: \\cern.ch\dfs\Applications\Altium\Datasheets\R0402_Phycomp_RC0402.pdf; Author: CERN DEM JLC; CreateDate: 03.12.2007; LatestRevisionDate: 17.10.2012
TP7-TP13 = SMD_PAD_1.27X1.27MM: Part Description: 1.27mm x 1.27mm PCB Copper Area (SMD Test Point); Mounted: No; Part Number: SMD_PAD_1.27X1.27MM; Component Kind: Standard (No BOM); Component Type: Standard (No BOM); Pin Count: 1; Family: Test Point; Socket: No; SMD: Yes; Sense: No; Status: None; ComponentHeight: 0mm; HelpURL: Undefined; Author: CERN DEM JLC; CreateDate: 12.01.2008; LatestRevisionDate: 12.01.2008; PackageDescription: 1.27mm x 1.27mm PCB Copper Area (SMD Test Point)